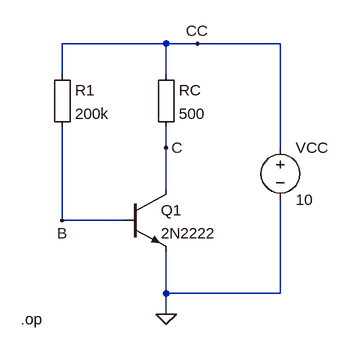
[diagram p0: schematic circuit2.asc]
circuit2.asc, the LTspice schematic file:
Version 4
SHEET 1 880 680
WIRE 256 -96 96 -96
WIRE 304 -96 256 -96
WIRE 432 -96 304 -96
WIRE 96 -48 96 -96
WIRE 256 -48 256 -96
WIRE 256 64 256 32
WIRE 432 64 432 -96
WIRE 256 128 256 64
WIRE 96 176 96 32
WIRE 192 176 96 176
WIRE 256 288 256 224
WIRE 432 288 432 144
WIRE 432 288 256 288
WIRE 256 320 256 288
FLAG 256 320 0
FLAG 256 64 C
FLAG 304 -96 CC
FLAG 96 176 B
SYMBOL npn 192 128 R0
SYMATTR InstName Q1
SYMATTR Value 2N2222
SYMBOL Misc\\EuropeanResistor 240 -64 R0
SYMATTR InstName RC
SYMATTR Value 500
SYMBOL Misc\\EuropeanResistor 80 -64 R0
SYMATTR InstName R1
SYMATTR Value 200k
SYMBOL voltage 432 48 R0
WINDOW 123 0 0 Left 0
WINDOW 39 0 0 Left 0
SYMATTR InstName VCC
SYMATTR Value 10
TEXT 32 328 Left 2 !.op

The netlist it stands for:
* circuit2.asc
Q1 C B 0 0 2N2222
RC CC C 500
R1 CC B 200k
VCC CC 0 10
.model NPN NPN
.model PNP PNP
.lib standard.bjt
.op
.backanno
.end